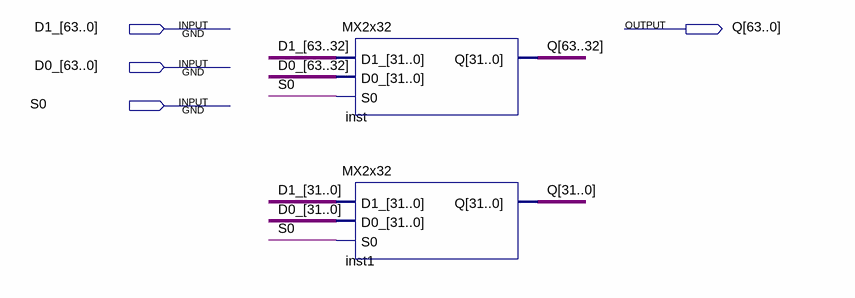
[diagram p0: schematic sheet]
// Quartus schematic MX2x64.bdf as structural Verilog: 2 symbols, 4 pins
module MX2x64 (
  input  [63:0] D1_,
  input  [63:0] D0_,
  input  S0,
  output [63:0] Q
);

  MX2x32 inst (.D1_(D1_[63:32]), .D0_(D0_[63:32]), .S0(S0), .Q(Q[63:32]));
  MX2x32 inst1 (.D1_(D1_[31:0]), .D0_(D0_[31:0]), .S0(S0), .Q(Q[31:0]));
endmodule
